# EAGLE design atmegademo (EAGLE 7.0.0)
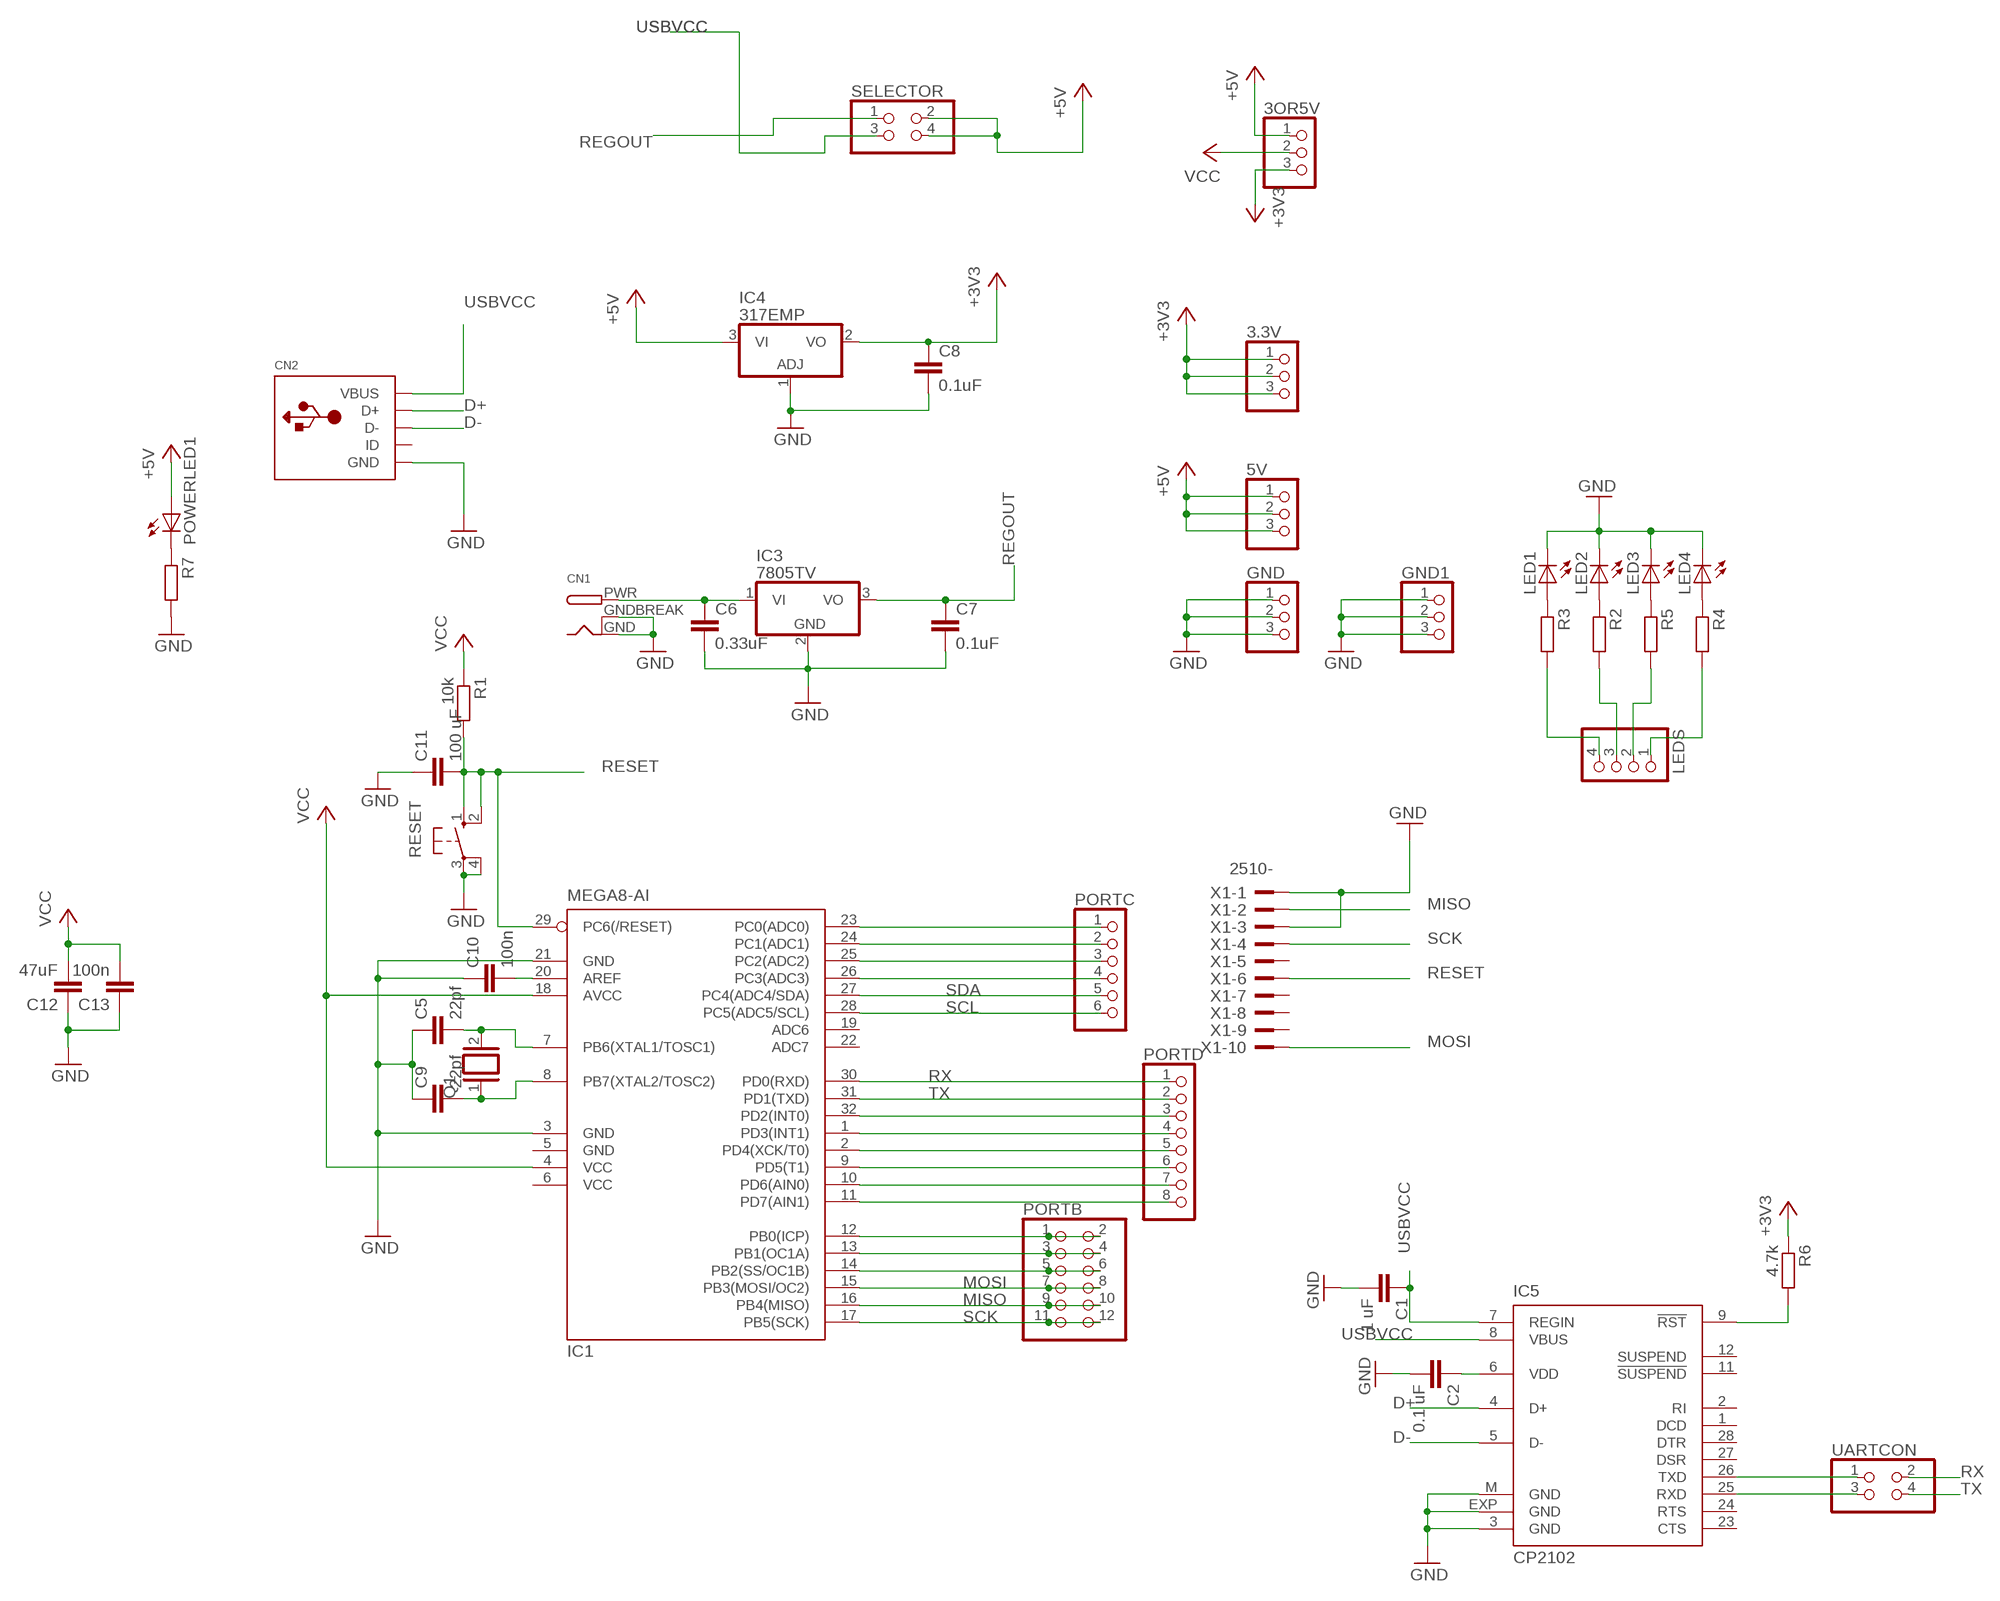
[diagram p0: schematic, sheet 1]

## Parts
3.3V  PINHD-1X3  [1X03]
3OR5V  PINHD-1X3  [1X03]
5V  PINHD-1X3  [1X03]
C1  1 uF  C-EUC0805K  [C0805K]
C2  0.1 uF  C-EUC0805K  [C0805K]
C5  22pf  C-EUC0805K  [C0805K]
C6  0.33uF  C-EUC0805K  [C0805K]
C7  0.1uF  C-EUC0805K  [C0805K]
C8  0.1uF  C-EUC0805K  [C0805K]
C9  22pf  C-EUC0805K  [C0805K]
C10  100n  C-EUC0805K  [C0805K]
C11  100 uF  C-EUC0805K  [C0805K]
C12  47uF  C-EUC0805K  [C0805K]
C13  100n  C-EUC0805K  [C0805K]
CN1  DCBARRELPTH  [DCJACK_2MM_PTH]
CN2  USBMINIB  [USB-MINIB]
GND  PINHD-1X3  [1X03]
GND1  PINHD-1X3  [1X03]
IC1  MEGA8-AI  [TQFP32-08]
IC3  7805TV  [TO220V]
IC4  317EMP  [SOT223]
IC5  CP2102  [MLP28]
LED1  LEDCHIPLED_1206  [CHIPLED_1206]
LED2  LEDCHIPLED_1206  [CHIPLED_1206]
LED3  LEDCHIPLED_1206  [CHIPLED_1206]
LED4  LEDCHIPLED_1206  [CHIPLED_1206]
LEDS  PINHD-1X4  [1X04]
PORTB  PINHD-2X6  [2X06]
PORTC  PINHD-1X6CLEAN  [1X06-CLEAN]
PORTD  PINHD-1X8CLEANBIG  [1X08-CLEANBIG]
POWERLED1  LEDCHIPLED_1206  [CHIPLED_1206]
Q1  XTAL/S  [QS]
R1  10k  R-EU_0207/12  [0207/12]
R2  R-EU_R0805  [R0805]
R3  R-EU_R0805  [R0805]
R4  R-EU_R0805  [R0805]
R5  R-EU_R0805  [R0805]
R6  4.7k  R-EU_R0805  [R0805]
R7  R-EU_R0805  [R0805]
RESET  10-XX  [B3F-10XX]
SELECTOR  PINHD-2X2  [2X02]
UARTCON  PINHD-2X2  [2X02]
X1  2510-  [PAK100/2500-10]

## Nets
+3V3: 3.3V.1 3.3V.2 3.3V.3 3OR5V.3 C8.1 IC4.2(VO) R6.1
+5V: 3OR5V.1 5V.1 5V.2 5V.3 IC4.3(VI) POWERLED1.A SELECTOR.2 SELECTOR.4
D+: CN2.D+ IC5.4(D+)
D-: CN2.D- IC5.5(D-)
GND: C1.2 C2.2 C5.1 C6.2 C7.2 C8.2 C9.1 C10.1 C11.1 C12.1 C13.1 CN1.GND CN1.GNDBREAK CN2.GND GND1.1 GND1.2 GND1.3 GND.1 GND.2 GND.3 IC1.3(GND) IC1.21(GND) IC3.2(GND) IC4.1(ADJ) IC5.3(GND) IC5.EXP(GND) IC5.M(GND) LED1.C LED2.C LED3.C LED4.C R7.2 RESET.3(P) RESET.4(P1) X1.1 X1.3
MISO: IC1.16(PB4(MISO)) PORTB.9 PORTB.10 X1.2
MOSI: IC1.15(PB3(MOSI/OC2)) PORTB.7 PORTB.8 X1.10
N$1: IC5.26(TXD) UARTCON.1
N$2: POWERLED1.C R7.1
N$3: C2.1 IC5.6(VDD)
N$4: IC5.9(!RST) R6.2
N$5: IC5.25(RXD) UARTCON.3
N$7: LEDS.4 R3.2
N$10: LEDS.3 R2.2
N$11: IC1.32(PD2(INT0)) PORTD.3
N$12: IC1.1(PD3(INT1)) PORTD.4
N$13: IC1.2(PD4(XCK/T0)) PORTD.5
N$14: C6.1 CN1.PWR IC3.1(VI)
N$15: IC1.9(PD5(T1)) PORTD.6
N$16: IC1.23(PC0(ADC0)) PORTC.1
N$17: IC1.10(PD6(AIN0)) PORTD.7
N$18: IC1.11(PD7(AIN1)) PORTD.8
N$19: IC1.24(PC1(ADC1)) PORTC.2
N$20: IC1.25(PC2(ADC2)) PORTC.3
N$21: IC1.26(PC3(ADC3)) PORTC.4
N$22: LEDS.2 R5.2
N$23: LED1.A R3.1
N$24: LED2.A R2.1
N$26: C10.2 IC1.20(AREF)
N$27: C5.2 IC1.7(PB6(XTAL1/TOSC1)) Q1.2
N$28: LED4.A R4.1
N$29: LED3.A R5.1
N$30: C9.2 IC1.8(PB7(XTAL2/TOSC2)) Q1.1
N$31: IC1.13(PB1(OC1A)) PORTB.3 PORTB.4
N$32: IC1.14(PB2(SS/OC1B)) PORTB.5 PORTB.6
N$33: IC1.12(PB0(ICP)) PORTB.1 PORTB.2
N$36: LEDS.1 R4.2
REGOUT: C7.1 IC3.3(VO) SELECTOR.1
RESET: C11.2 IC1.29(PC6(/RESET)) R1.2 RESET.1(S) RESET.2(S1) X1.6
RX: IC1.30(PD0(RXD)) PORTD.1 UARTCON.2
SCK: IC1.17(PB5(SCK)) PORTB.11 PORTB.12 X1.4
SCL: IC1.28(PC5(ADC5/SCL)) PORTC.6
SDA: IC1.27(PC4(ADC4/SDA)) PORTC.5
TX: IC1.31(PD1(TXD)) PORTD.2 UARTCON.4
USBVCC: C1.1 CN2.VBUS IC5.7(REGIN) IC5.8(VBUS) SELECTOR.3
VCC: 3OR5V.2 C12.2 C13.2 IC1.4(VCC) IC1.18(AVCC) R1.1
Unconnected: CN2.ID IC1.19(ADC6) IC1.22(ADC7) IC5.1(DCD) IC5.2(RI) IC5.11(!SUSPEND) IC5.12(SUSPEND) IC5.23(CTS) IC5.24(RTS) IC5.27(DSR) IC5.28(DTR) X1.5 X1.7 X1.8 X1.9

## Power pins joined to a net without a drawn wire
GND: IC1.5(GND)
VCC: IC1.6(VCC)

## Library data of the parts
3.3V 3OR5V 5V GND GND1 = adafruit:PINHD-1X3: PIN HEADER
C1 C2 C5-C13 = resistor:C-EU: CAPACITOR, European symbol
CN1 = adafruit:DCBARREL: 2.0mm DC Barrel Jack DCJACK_2MM_PTH - Through Hole Jack (4UConnector: 05537)
CN2 = adafruit:USB: USB Connectors USBMINIB - Surface Mount Female Mini-B USB Connector 4UConnector: 06564 By microbuilder.eu Thru-hole RA Female Mini-B USB Connector 4UConnector: 18732 By ladyada.net
IC1 = atmel:MEGA8: MICROCONTROLLER 8 Kbytes FLASH, 1 kbytes SRAM, 512 bytes EEPROM, USART, 6-channel 10 bit ADC, 2-channel 8 bit ADC Pin compatible with Atmega48, ATMega88, ATMega168 Source: avr.lbr; MPN: ATMEGA8-16AU; OC_FARNELL: 9171371; OC_NEWARK: 73M8863
IC3 = linear:78*: Positive VOLTAGE REGULATOR Source: http://cache.national.com/ds/LM/LM78L05.pdf http://www.fairchildsemi.com/ds/LM/LM7805.pdf
IC4 = linear:*317: Positive VOLTAGE REGULATOR
IC5 = silabs:CP210*: Single-Chip USB to UART Bridge Source: www.silabs.com .. CP2101.pdf / cp2102.pdf; MF: FARNELL; MPN: CP2102-GM; OC_FARNELL: 9282130; OC_NEWARK: 30K5635
LED1-LED4 POWERLED1 = led:LED: LED OSRAM: - CHIPLED LG R971, LG N971, LY N971, LG Q971, LY Q971, LO R971, LY R971 LH N974, LH R974 LS Q976, LO Q976, LY Q976 LO Q996 - Hyper CHIPLED LW Q18S LB Q993, LB Q99A, LB R99A - SideLED LS A670, LO A670, LY A670, LG A670, LP A670 LB A673, LV A673, LT A673, LW A673 LH A674 LY A675 LS A676, LA A676, LO A676, LY A676, LW A676 LS A679, LY A679, LG A679 - Hyper Micro SIDELED® LS Y876, LA Y876, LO Y876, LY Y876 LT Y87S - SmartLED LW L88C, LW L88S LB L89C, LB L89S, LG L890 LS L89K, LO L89K, LY L89K LS L896, LA L896, LO L896, LY L896 - TOPLED LS T670, LO T670, LY T670, LG T670, LP T670 LSG T670, LSP T670, LSY T670, LOP T670, LYG T670 LG T671, LOG T671, LSG T671 LB T673, LV T673, LT T673, LW T673 LH T674 LS T676, LA T676, LO T676, LY T676, LB T676, LH T676, LSB T676, LW T676 LB T67C, LV T67C, LT T67C, LS T67K, LO T67K, LY T67K, LW E67C LS E67B, LA E67B, LO E67B, LY E67B, LB E67C, LV E67C, LT E67C LW T67C LS T679, LY T679, LG T679 LS T770, LO T770, LY T770, LG T770, LP T770 LB T773, LV T773, LT T773, LW T773 LH T774 LS E675, LA E675, LY E675, LS T675 LS T776, LA T776, LO T776, LY T776, LB T776 LHGB T686 LT T68C, LB T68C - Hyper Mini TOPLED® LB M676 - Mini TOPLED Santana® LG M470 LS M47K, LO M47K, LY M47K Source: http://www.osram.convergy.de LUXEON: - LUMILED® LXK2-PW12-R00, LXK2-PW12-S00, LXK2-PW14-U00, LXK2-PW14-V00 LXK2-PM12-R00, LXK2-PM12-S00, LXK2-PM14-U00 LXK2-PE12-Q00, LXK2-PE12-R00, LXK2-PE12-S00, LXK2-PE14-T00, LXK2-PE14-U00 LXK2-PB12-K00, LXK2-PB12-L00, LXK2-PB12-M00, LXK2-PB14-N00, LXK2-PB14-P00, LXK2-PB14-Q00 LXK2-PR12-L00, LXK2-PR12-M00, LXK2-PR14-Q00, LXK2-PR14-R00 LXK2-PD12-Q00, LXK2-PD12-R00, LXK2-PD12-S00 LXK2-PH12-R00, LXK2-PH12-S00 LXK2-PL12-P00, LXK2-PL12-Q00, LXK2-PL12-R00 Source: www.luxeon.com KINGBRIGHT: KA-3528ASYC Source: www.kingbright.com
LEDS = pinhead:PINHD-1X4: PIN HEADER
PORTB = pinhead:PINHD-2X6: PIN HEADER
PORTC = adafruit:PINHD-1X6: PIN HEADER
PORTD = adafruit:PINHD-1X8: PIN HEADER
Q1 = special:XTAL/S: CRYSTAL
R1-R7 = resistor:R-EU_: RESISTOR, European symbol
RESET = switch-omron:10-XX: OMRON SWITCH; MPN: B3F-1000; OC_FARNELL: 176432; OC_NEWARK: 36M3542
SELECTOR UARTCON = pinhead:PINHD-2X2: PIN HEADER
X1 = con-3m:2510-: 3M (TM) Pak 100 4-Wall Header Source: 3M; MF: 3M; MPN: 2510-6002UB; OC_FARNELL: 9838244; OC_NEWARK: 46F4725

## Net classes
0 default: clearance 0.355 mm

## Board
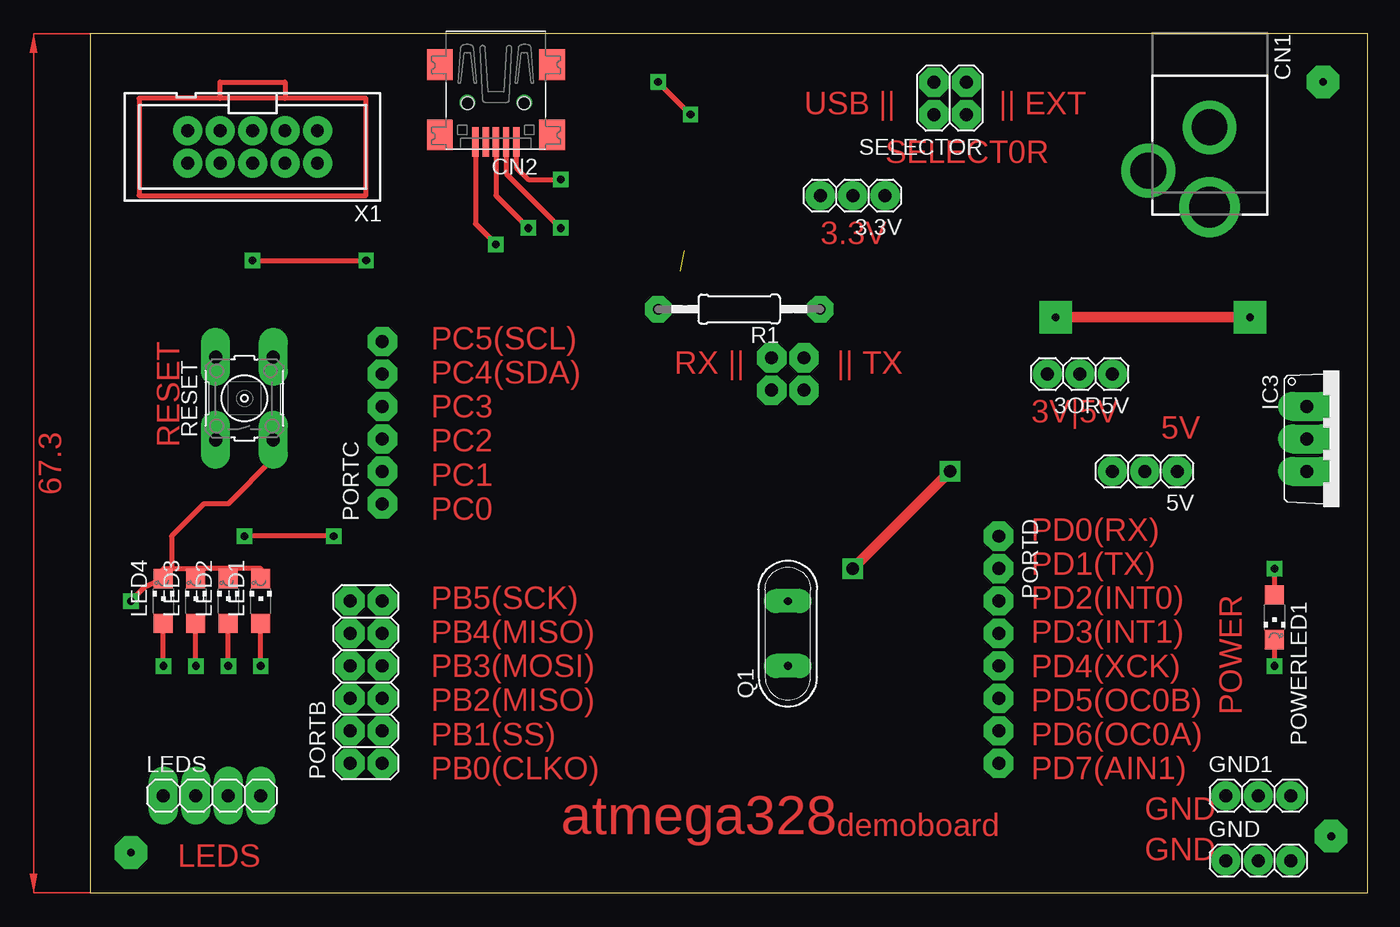
[diagram p1: board, top side]
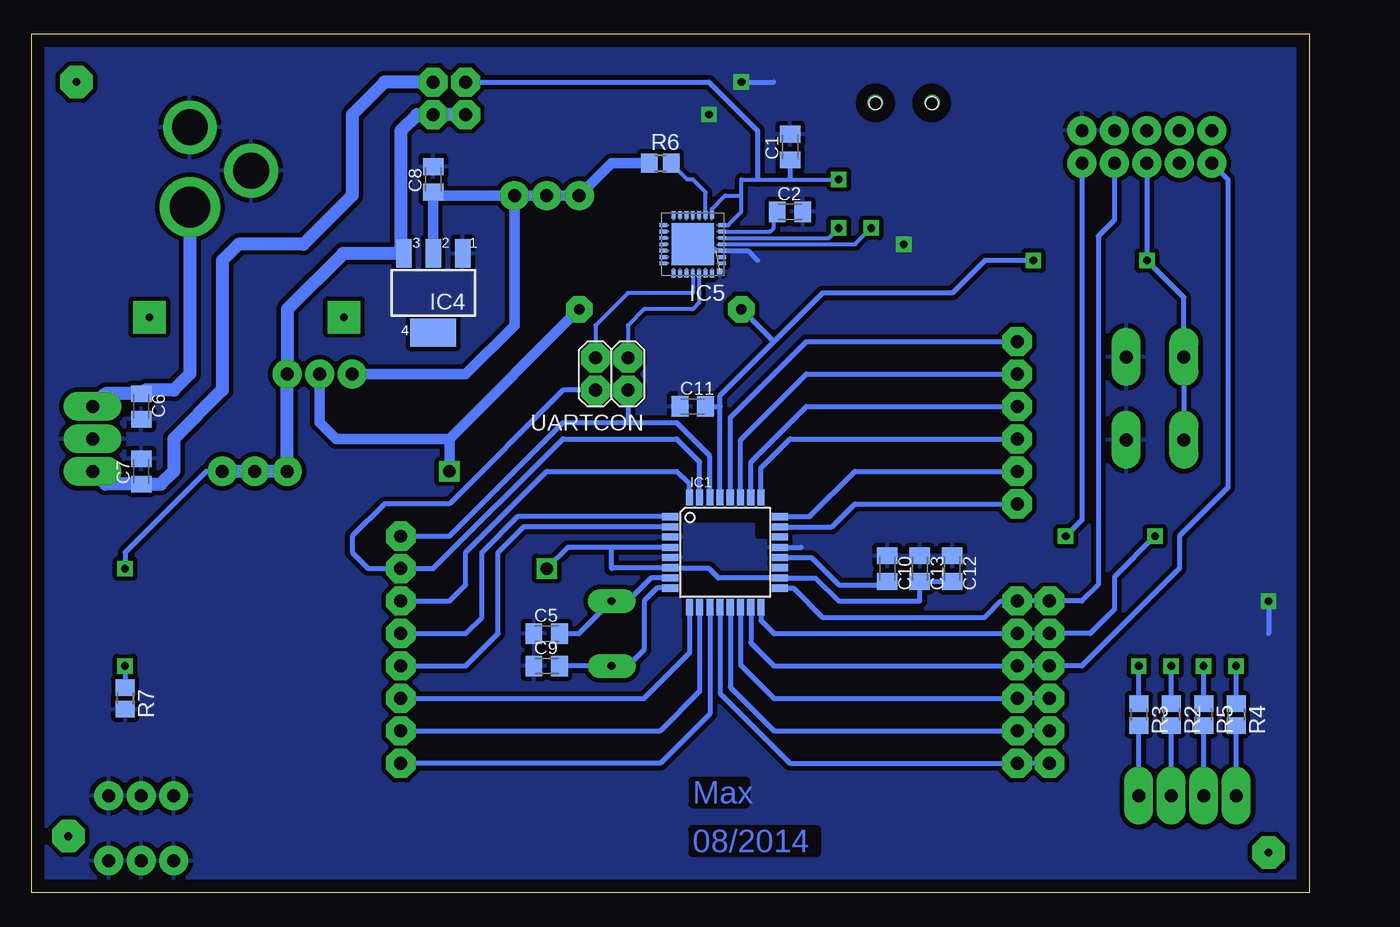
[diagram p2: board, bottom side, seen from below]

Size 100 x 67.3 mm. Coordinates in mm from the lower left corner, seen from the top.
Outline: 0,0 100,0 100,67.3 0,67.3 0,0
Copper layers (1*16): Top 0.035mm / dielectric 1.5mm / Bottom 0.035mm
Design rules "default": minimum track width 10mil, minimum drill 32mil, track to track 12mil, track to pad 12mil, pad to pad 12mil, via to via 12mil, smd to smd 8mil, copper to edge 40mil, drill to drill 40mil, minimum pad ring 25mil, minimum via ring 12mil, stop-mask expansion 4mil, vias tented up to drill 0mil, thermal gap 15mil
bRestrict: area 42.5,29.2 to 48.9,29.8; area 42.5,27.9 to 43.2,29.2

### Footprints (pad centres in the part's own frame; a part is rotated, then mirrored left to right if it is on the bottom)
1X03 = drill 1.016: 1 -2.54,0; 2 0,0; 3 2.54,0
C0805K = smd 1.3 x 1.6: 1 -1,0; 2 1,0
DCJACK_2MM_PTH = drill 2.8: GND 0,7.35; GNDBREAK 4.8,10.75 | drill 3.2: PWR 0,13.6
USB-MINIB = smd 0.5 x 2.308: D+ 0,4.064; D- -0.8,4.064; GND 1.6,4.064; ID 0.8,4.064; VBUS -1.6,4.064 | smd 2 x 2.4: GND1 -4.4,-2; GND2 -4.4,3.5; GND3 4.4,3.5; GND4 4.4,-2 | hole 1: -2.2,1; 2.2,1
TQFP32-08 = smd 1.27 x 0.559: 1 -4.293,2.8; 2 -4.293,2; 3 -4.293,1.2; 4 -4.293,0.4; 5 -4.293,-0.4; 6 -4.293,-1.2; 7 -4.293,-2; 8 -4.293,-2.8; 17 4.293,-2.8; 18 4.293,-2; 19 4.293,-1.2; 20 4.293,-0.4; 21 4.293,0.4; 22 4.293,1.2; 23 4.293,2; 24 4.293,2.8 | smd 0.559 x 1.27: 9 -2.8,-4.293; 10 -2,-4.293; 11 -1.2,-4.293; 12 -0.4,-4.293; 13 0.4,-4.293; 14 1.2,-4.293; 15 2,-4.293; 16 2.8,-4.293; 25 2.8,4.293; 26 2,4.293; 27 1.2,4.293; 28 0.4,4.293; 29 -0.4,4.293; 30 -1.2,4.293; 31 -2,4.293; 32 -2.8,4.293
TO220V = drill 1.016 long: 1 -2.54,-2.54; 2 0,-2.54; 3 2.54,-2.54
SOT223 = smd 1.219 x 2.235: 1 -2.311,-3.099; 2 0,-3.099; 3 2.311,-3.099 | smd 3.6 x 2.2: 4 0,3.099
MLP28 = smd 0.6 x 0.3: 1 -2.3,1.5; 2 -2.3,1; 3 -2.3,0.5; 4 -2.3,0; 5 -2.3,-0.5; 6 -2.3,-1; 7 -2.3,-1.5; 15 2.3,-1.5; 16 2.3,-1; 17 2.3,-0.5; 18 2.3,0; 19 2.3,0.5; 20 2.3,1; 21 2.3,1.5 | smd 0.3 x 0.6: 8 -1.5,-2.3; 9 -1,-2.3; 10 -0.5,-2.3; 11 0,-2.3; 12 0.5,-2.3; 13 1,-2.3; 14 1.5,-2.3; 22 1.5,2.3; 23 1,2.3; 24 0.5,2.3; 25 0,2.3; 26 -0.5,2.3; 27 -1,2.3; 28 -1.5,2.3 | smd 3.3 x 3.3: EXP 0,0 | smd 0.435 x 0.435: M -2.103,2.103
CHIPLED_1206 = smd 1.5 x 1.5: A 0,-1.75; C 0,1.75
1X04 = drill 1.016 long: 1 -3.81,0; 2 -1.27,0; 3 1.27,0; 4 3.81,0
2X06 = drill 1.016 octagon: 1 -6.35,-1.27; 2 -6.35,1.27; 3 -3.81,-1.27; 4 -3.81,1.27; 5 -1.27,-1.27; 6 -1.27,1.27; 7 1.27,-1.27; 8 1.27,1.27; 9 3.81,-1.27; 10 3.81,1.27; 11 6.35,-1.27; 12 6.35,1.27
1X06-CLEAN = drill 1.016 octagon: 1 -6.35,0; 2 -3.81,0; 3 -1.27,0; 4 1.27,0; 5 3.81,0; 6 6.35,0
1X08-CLEANBIG = drill 1.016 pad 1.778 octagon: 1 -8.89,0; 2 -6.35,0; 3 -3.81,0; 4 -1.27,0; 5 1.27,0; 6 3.81,0; 7 6.35,0; 8 8.89,0
QS = drill 0.61 long: 1 -2.54,0; 2 2.54,0
0207/12 = drill 0.813 octagon: 1 -6.35,0; 2 6.35,0
R0805 = smd 1.3 x 1.5: 1 -0.85,0; 2 0.85,0
B3F-10XX = drill 1.016 long: 1 -3.251,2.261; 2 3.251,2.261; 3 -3.251,-2.261; 4 3.251,-2.261
2X02 = drill 1.016 octagon: 1 -1.27,-1.27; 2 -1.27,1.27; 3 1.27,-1.27; 4 1.27,1.27
PAK100/2500-10 = drill 1 pad 1.422: 1 -5.08,-1.27; 2 -5.08,1.27; 3 -2.54,-1.27; 4 -2.54,1.27; 5 0,-1.27; 6 0,1.27; 7 2.54,-1.27; 8 2.54,1.27; 9 5.08,-1.27; 10 5.08,1.27

### Placement (x,y rotation side)
3.3V  59.69,54.61 180 top
3OR5V  77.47,40.64 180 top
5V  82.55,33.02 180 top
C1  40.64,58.42 90 bottom
C2  40.64,53.34 0 bottom
C5  59.69,20.32 0 bottom
C6  91.44,38.1 270 bottom
C7  91.44,33.02 90 bottom
C8  68.58,55.88 90 bottom
C9  59.69,17.78 0 bottom
C10  33.02,25.4 270 bottom
C11  48.26,38.1 0 bottom
C12  27.94,25.4 270 bottom
C13  30.48,25.4 270 bottom
CN1  87.63,67.31 180 top
CN2  31.75,62.86 180 top
GND  91.44,2.54 0 top
GND1  91.44,7.62 0 top
IC1  45.72,26.67 0 bottom
IC3  97.79,35.56 270 top
IC4  68.58,46.99 180 bottom
IC5  48.26,50.8 180 bottom
LED1  13.34,22.86 0 top
LED2  10.79,22.86 0 top
LED3  8.26,22.86 0 top
LED4  5.71,22.86 0 top
LEDS  9.53,7.62 0 top
PORTB  21.59,16.51 90 top
PORTC  22.86,36.83 90 top
PORTD  71.12,19.05 270 top
POWERLED1  92.71,21.59 180 top
Q1  54.61,20.32 90 top
R1  50.8,45.72 180 top
R2  10.79,13.97 270 bottom
R3  13.34,13.97 270 bottom
R4  5.71,13.97 270 bottom
R5  8.26,13.97 270 bottom
R6  50.8,57.15 0 bottom
R7  92.71,15.24 270 bottom
RESET  12.06,38.73 90 top
SELECTOR  67.31,62.23 180 top
UARTCON  54.61,40.64 180 bottom
X1  12.7,58.42 180 top

### Tracks (layer width: path | path; a pad name or v marks a point on that pad's centre or on a via)
+3V3
  Bottom 0.406: 68.31,54.61 C8.1
  Bottom 0.813: IC4.2 C8.1 | 3.3V.1 68.31,54.61 | R6.1 54.61,57.15 3.3V.3 3.3V.2 3.3V.1 | 3.3V.1 62.23,44.45 66.04,40.64 3OR5V.3
+5V  (via drill 0.6)
  Top 0.406: v92.71,25.4 POWERLED1.A
  Bottom 0.406: SELECTOR.2 69.85,60.96 | 71.12,50.32 IC4.3 | 5V.1 86.36,33.02 92.71,26.67 v92.71,25.4
  Bottom 1.016: 69.85,60.96 71.12,59.69 71.12,50.32 | IC4.3 75.64,50.09 80.01,45.72 3OR5V.1 5V.3 5V.2 5V.1 | SELECTOR.4 SELECTOR.2
D+  (via drill 0.6)
  Top 0.406: CN2.D+ 31.75,54.61 v34.29,52.07
  Bottom 0.305: IC5.4 35.56,50.8 v34.29,52.07
D-  (via drill 0.6)
  Top 0.406: CN2.D- 32.55,56.35 v36.83,52.07
  Bottom 0.305: IC5.5 37.6,51.3 v36.83,52.07
GND  (via drill 0.6)  (1 unrouted)
  Top 0.406: CN2.GND 30.15,52.4 v31.75,50.8 | 6.35,25.4 5.71,25.4 LED4.C 4.22,23.91 v3.17,22.86 | 6.35,25.4 8.26,25.4 | 8.26,25.4 LED3.C | LED2.C 10.79,25.4 | 10.79,25.4 8.26,25.4 | LED1.C 13.34,25.4 10.79,25.4 | v46.99,60.96 v44.45,63.5 | RESET.3 14.33,34.01 10.79,30.48 8.89,30.48 6.35,27.94 6.35,25.4
  Bottom 0.406: IC1.21 39.77,27.07 | 43.18,49.53 43.95,50.3 IC5.3 46.49,50.3 46.99,50.8 IC5.EXP | v3.17,22.86 3.17,20.32 | v44.45,63.5 41.91,63.5
  pour Bottom: -1.27,71.12 104.14,71.12 104.14,-17.78 -1.27,-17.78
MISO  (via drill 0.6)
  Top 0.406: v19.05,27.94 v12.06,27.94
  Bottom 0.406: IC1.16 42.92,21.33 41.91,20.32 PORTB.9 PORTB.10 17.14,20.32 15.24,22.22 15.24,24.77 v12.06,27.94 | X1.2 17.78,29.21 v19.05,27.94
MOSI
  Bottom 0.406: IC1.15 43.72,19.59 41.91,17.78 PORTB.7 PORTB.8 17.78,17.78 10.16,25.4 10.16,27.94 6.35,31.75 6.35,55.88 X1.10
N$1
  Bottom 0.305: IC5.26 47.76,46.22 48.26,45.72 52.07,45.72 53.34,44.45 UARTCON.1
N$2  (via drill 0.6)
  Top 0.406: POWERLED1.C v92.71,17.78
  Bottom 0.406: v92.71,17.78 R7.1
N$3
  Bottom 0.305: IC5.6 42.18,51.8 41.91,52.07 41.91,53.07
  Bottom 0.406: 41.91,53.07 C2.1
N$4
  Bottom 0.305: IC5.9 47.26,54.88 48.26,55.88 48.68,55.88 R6.2
N$5
  Bottom 0.305: IC5.25 48.26,46.99 53.34,46.99 55.88,44.45 UARTCON.3
N$6
  Top 0.406: 15.24,62.23 21.59,62.23 21.59,54.61 3.81,54.61 3.81,62.23 10.16,62.23 | 15.24,62.23 10.16,62.23 | 10.16,62.23 10.16,63.5 15.24,63.5 15.24,62.23
N$7
  Bottom 0.406: LEDS.4 R3.2
N$8  (via drill 0.6 pad 2.54)
  other vias: 3.17,3.18
N$9  (via drill 0.6 pad 2.54)
  other vias: 97.16,4.45
N$10
  Bottom 0.406: LEDS.3 R2.2
N$11
  Bottom 0.406: PORTD.3 67.31,22.86 66.04,24.13 66.04,26.67 59.69,33.02 49.53,33.02 48.52,32.01 IC1.32
N$12
  Bottom 0.406: PORTD.4 66.04,20.32 64.77,21.59 64.77,26.67 61.97,29.47 IC1.1
N$13
  Bottom 0.406: PORTD.5 66.04,17.78 63.5,20.32 63.5,26.67 62.87,27.31 62.23,27.94 61.5,28.67 IC1.2
N$14
  Bottom 1.016: CN1.PWR 87.63,40.64 88.9,39.37 91.17,39.37 C6.1 94.25,39.1 IC3.1
N$15
  Bottom 0.406: PORTD.6 52.07,15.24 48.52,18.79 IC1.9
N$16
  Bottom 0.406: IC1.23 37.37,28.67 35.56,30.48 PORTC.1
N$17
  Bottom 0.406: PORTD.7 50.8,12.7 47.72,15.78 IC1.10
N$18
  Bottom 0.406: IC1.11 46.92,14.04 50.8,10.16 PORTD.8
N$19
  Bottom 0.406: IC1.24 39.11,29.47 35.56,33.02 PORTC.2
N$20
  Bottom 0.406: IC1.25 42.92,33.28 40.64,35.56 PORTC.3
N$21
  Bottom 0.406: IC1.26 43.72,33.75 39.37,38.1 PORTC.4
N$22
  Bottom 0.406: LEDS.2 R5.2
N$23  (via drill 0.6)
  Top 0.406: v13.34,17.78 LED1.A
  Bottom 0.406: R3.1 v13.34,17.78
N$24  (via drill 0.6)
  Top 0.406: v10.79,17.78 LED2.A
  Bottom 0.406: R2.1 v10.79,17.78
N$25  (via drill 0.6 pad 2.54)
  other vias: 96.52,63.5
N$26
  Bottom 0.406: IC1.20 38.97,26.27 36.83,24.13 33.29,24.13 C10.2
N$27
  Bottom 0.406: IC1.7 51.53,24.67 53.34,22.86 Q1.2 57.15,20.32 C5.2
N$28  (via drill 0.6)
  Top 0.406: v5.71,17.78 LED4.A
  Bottom 0.406: R4.1 v5.71,17.78
N$29  (via drill 0.6)
  Top 0.406: v8.26,17.78 LED3.A
  Bottom 0.406: R5.1 v8.26,17.78
N$30
  Bottom 0.406: IC1.8 51.06,23.87 52.07,22.86 52.07,19.05 53.34,17.78 Q1.1 C9.2
N$31
  Bottom 0.406: IC1.13 45.32,16.11 41.91,12.7 PORTB.3 PORTB.4
N$32
  Bottom 0.406: IC1.14 44.52,17.85 41.91,15.24 PORTB.5 PORTB.6
N$33
  Bottom 0.406: IC1.12 46.12,15.64 40.64,10.16 PORTB.1 PORTB.2
N$34  (via drill 0.6)
  other vias: 29.53,61.91
N$35  (via drill 0.6 pad 2.54)
  Top 0.813: v75.56,45.08 v90.81,45.08
N$36
  Bottom 0.406: LEDS.1 R4.2
N$37  (via drill 0.6)
  other vias: 33.97,61.91
REGOUT
  Bottom 1.016: IC3.3 94.25,32.02 C7.1 89.9,32.02 88.9,33.02 88.9,35.56 85.09,39.37 85.09,49.53 83.82,50.8 78.74,50.8 74.93,54.61 74.93,60.96 72.39,63.5 SELECTOR.1
RESET  (via drill 0.6)
  Top 0.406: v12.7,49.53 v21.59,49.53
  Bottom 0.406: X1.6 v12.7,49.53 9.8,46.63 RESET.2 RESET.1 | v21.59,49.53 25.4,49.53 27.94,46.99 38.1,46.99 41.91,43.18 | 41.91,43.18 46.12,38.97 46.12,38.1 | IC1.29 46.12,38.1 | C11.2 46.12,38.1 | 41.91,43.18 R1.2
RX
  Bottom 0.406: PORTD.1 67.31,27.94 58.42,36.83 53.34,36.83 | 53.34,36.83 49.53,36.83 46.92,34.22 IC1.30 | UARTCON.2 53.34,36.83
SCK
  Bottom 0.406: IC1.17 40.38,23.87 38.1,21.59 25.4,21.59 24.13,22.86 PORTB.11 PORTB.12 17.78,22.86 16.51,24.13 16.51,51.44 15.24,52.7 X1.4
SCL
  Bottom 0.406: IC1.28 45.32,37.23 39.37,43.18 PORTC.6
SDA
  Bottom 0.406: IC1.27 44.52,35.49 39.37,40.64 PORTC.5
TX
  Bottom 0.406: IC1.31 47.72,33.75 49.53,35.56 58.42,35.56 68.58,25.4 PORTD.2 73.66,25.4 74.93,26.67 74.93,27.94 72.39,30.48 67.31,30.48 58.42,39.37 UARTCON.4
USBVCC  (via drill 0.6)
  Top 0.406: CN2.VBUS 33.35,56.82 34.29,55.88 v36.83,55.88
  Bottom 0.305: IC5.7 45.49,52.3 44.45,53.34 44.45,54.61 | 44.45,54.61 44.45,55.88 43.18,55.88 40.64,55.88 v36.83,55.88 | IC5.8 46.76,53.57 45.72,54.61 44.45,54.61
  Bottom 0.406: SELECTOR.3 46.99,63.5 43.18,59.69 43.18,55.88 | C1.1 40.64,55.88
VCC  (via drill 1)
  Top 0.813: v59.69,25.4 v67.31,33.02
  Bottom 0.406: IC1.4 54.61,27.07 | 54.61,27.07 58.02,27.07 v59.69,25.4 | 54.61,27.07 54.61,25.4 54.54,25.47 IC1.6 49.94,25.4 46.99,25.4 46.26,24.67 IC1.18 38.64,24.67 36.83,22.86 30.48,22.86 C13.2 C12.2
  Bottom 0.813: v67.31,33.02 67.31,35.56 | 67.31,35.56 76.2,35.56 77.47,36.83 3OR5V.2 | R1.1 67.31,35.56
(copper drawn outside any net)
  shapes: Top area x1

### Text on the board
Top: USB || | || EXT | SELECT0R | 3.3V | RX || | || TX | 3V|5V | RESET | 5V | PC5(SCL) / PC4(SDA) / PC3 / PC2 / PC1 / PC0 | POWER | PB5(SCK) / PB4(MISO) / PB3(MOSI) / PB2(MISO) / PB1(SS) / PB0(CLKO) | PD0(RX) / PD1(TX) / PD2(INT0) / PD3(INT1) / PD4(XCK) / PD5(OC0B) / PD6(OC0A) / PD7(AIN1) | atmega328 | GND | LEDS | demoboard | GND
Bottom: Max | 08/2014